# EasyEDA schematic 1-Schematic_MicroCubeSat.json
TITLE: MicroCubeSat_A; REV: 1.0; Date: 2025-03-25; Sheet: 1/1; Drawn By: cookiealpha; Company: Miari
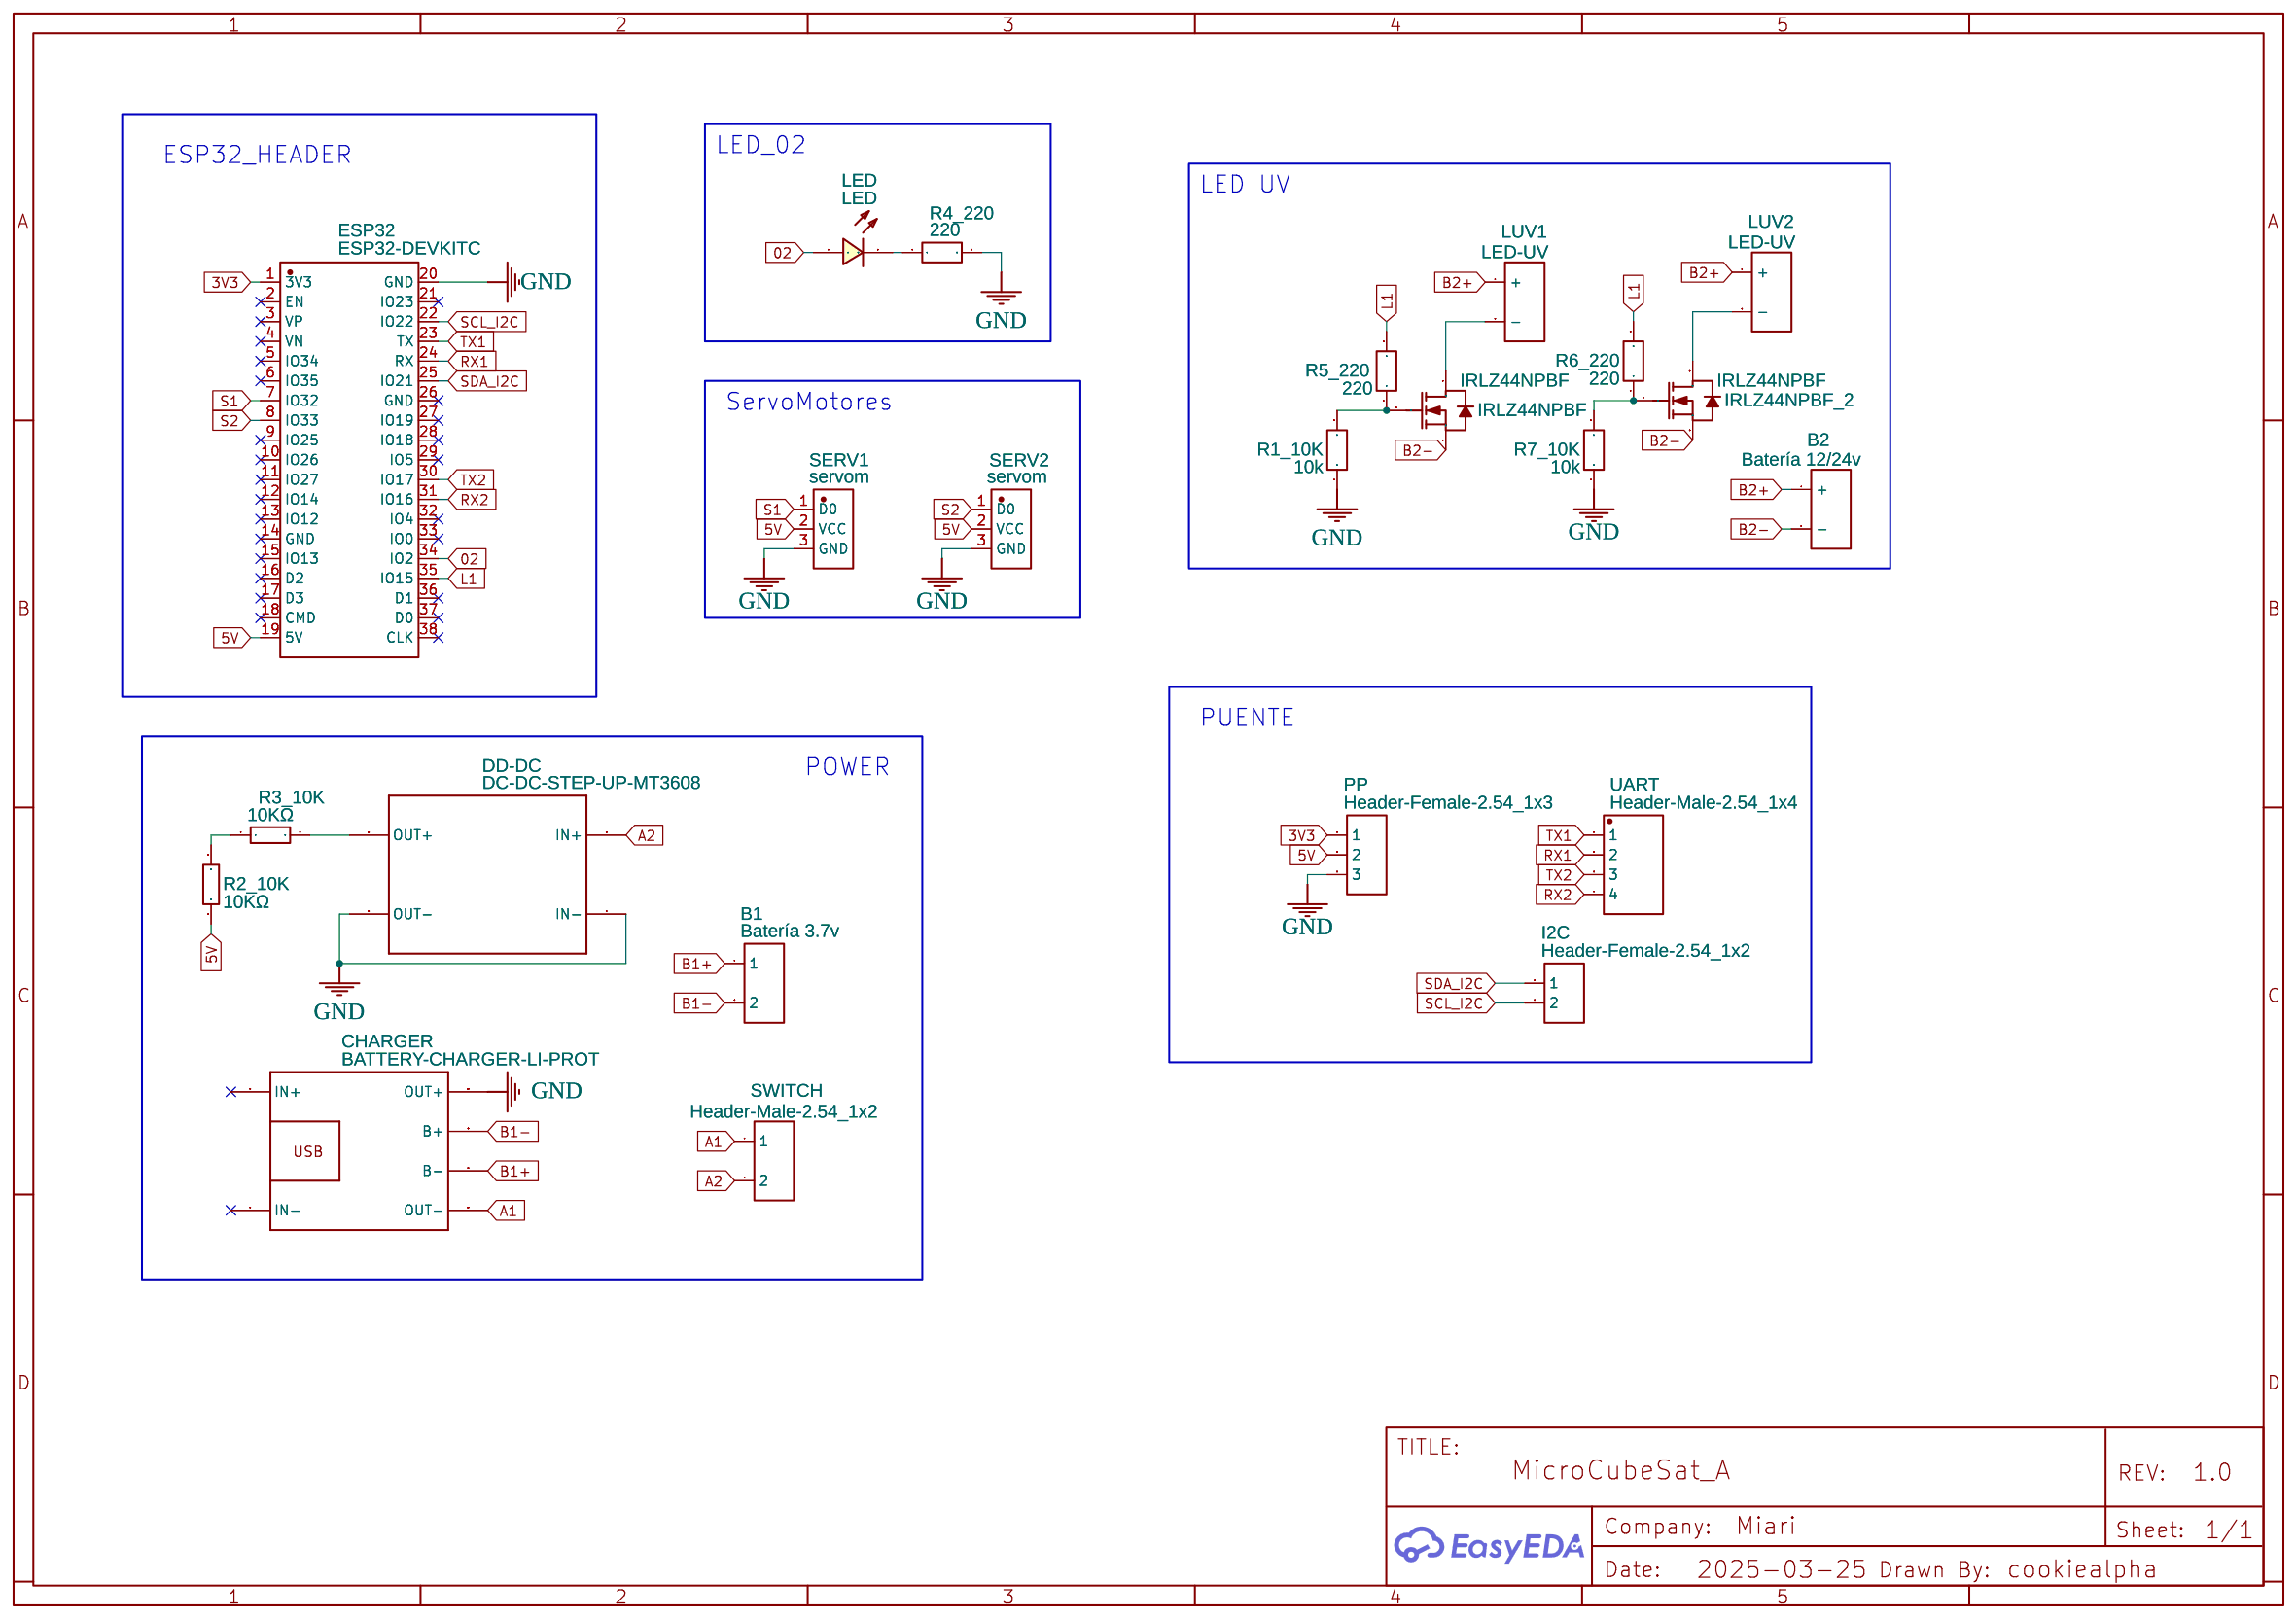
[diagram p0: schematic sheet]

## Parts
B1  Batería 3.7v  [HDR-TH_2P-P2.54-V-M-1]
B2  Batería 12/24v  [HDR-TH_2P-P2.54-V-M-1]
CHARGER  BATTERY-CHARGER-LI-PROT  [BATTERY-CHARGER-LI-PROT]
DD-DC  DC-DC-STEP-UP-MT3608  [DC-DC-STEP-UP-MT3608]
ESP32  ESP32-DEVKITC  [BULETM-SMD_ESP32-DEVKITC]
I2C  Header-Female-2.54_1x2  [HDR-TH_2P-P2.54-V-F]
IRLZ44NPBF  IRLZ44NPBF  [TO-220-3_L10.0-W4.5-P2.54-T]
IRLZ44NPBF_2  IRLZ44NPBF  [TO-220-3_L10.0-W4.5-P2.54-T]
LED  LED  [LED-TH_LED-3MM_RED]
LUV1  LED-UV  [HDR-TH_2P-P2.54-V-M-1]
LUV2  LED-UV  [HDR-TH_2P-P2.54-V-M-1]
PP  Header-Female-2.54_1x3  [HDR-TH_3P-P2.54-V-F]
R1_10K  10k  [RESISTORAXIAL1/2WLHOLES15MM]
R2_10K  10KΩ  [RESISTANCE 10K]
R3_10K  10KΩ  [RESISTANCE 10K]
R4_220  220  [RESISTORAXIAL1/2WLHOLES15MM]
R5_220  220  [RESISTORAXIAL1/2WLHOLES15MM]
R6_220  220  [RESISTORAXIAL1/2WLHOLES15MM]
R7_10K  10k  [RESISTORAXIAL1/2WLHOLES15MM]
SERV1  servom  [CONN-TH_HX-PZ2.54-1X3P-ZZ]
SERV2  servom  [CONN-TH_HX-PZ2.54-1X3P-ZZ]
SWITCH  Header-Male-2.54_1x2  [HDR-TH_2P-P2.54-V-M-1]
UART  Header-Male-2.54_1x4  [HDR-TH_4P-P2.54-V-M]

## Library data of the parts
B1 B2 LUV1 LUV2 SWITCH = Header-Male-2.54_1x2: Supplier: LCSC; Manufacturer: TE Connectivity(泰科电子); Manufacturer Part: 826629-2; Supplier Part: C86471; JLCPCB Part Class: Extended Part
CHARGER = BATTERY-CHARGER-LI-PROT: Contributor: Azias
DD-DC = DC-DC-STEP-UP-MT3608: Contributor: moung
ESP32 = ESP32-DEVKITC: Supplier: LCSC; Supplier Part: C571180; Manufacturer: ESPRESSIF(乐鑫); Manufacturer Part: ESP32-DevKitC; Contributor: lcsc; JLCPCB Part Class: Extended Part
I2C = Header-Female-2.54_1x2: Supplier: LCSC; Manufacturer: BOOMELE(博穆精密); Manufacturer Part: 2.54-1*2P母; Supplier Part: C49661; JLCPCB Part Class: Extended Part
IRLZ44NPBF IRLZ44NPBF_2 = IRLZ44NPBF: Supplier: LCSC; Manufacturer: Infineon(英飞凌); Supplier Part: C38774; JLCPCB Part Class: Extended Part
LED = LED05-红灯: Contributor: LCSC; Supplier: LCSC; Supplier Part: C9900009041; Manufacturer: null; JLCPCB Part Class: Extended Part
PP = Header-Female-2.54_1x3: Supplier Part: C146243; Supplier: LCSC; Manufacturer: BOOMELE(博穆精密); Manufacturer Part: 2.54-1*3P母; JLCPCB Part Class: Extended Part
R1_10K R4_220 R5_220 R6_220 R7_10K = ResistorAxial1/2wLHoles13.89mm: Contributor: 21102406
R2_10K R3_10K = RESISTANCE_10k: Supplier: LCSC; Supplier Part: C123392; Manufacturer: Nanjing Shiheng Elec; Manufacturer Part: MF58 103J3470; Contributor: Evgeniy_ANP; JLCPCB Part Class: Extended Part
SERV1 SERV2 = HX PZ2.54-1X3P ZZ: Supplier: LCSC; Supplier Part: C32713269; Manufacturer: hanxia(韩下); Manufacturer Part: HX PZ2.54-1x3P ZZ; JLCPCB Part Class: Extended Part; Contributor: lcsc
UART = Header-Male-2.54_1x4: Contributor: LCSC; Supplier: LCSC; Manufacturer: Ckmtw(灿科盟); Manufacturer Part: B-2100S04P-A110; Supplier Part: C124378; JLCPCB Part Class: Extended Part

## Nets
3V3: ESP32.1(3V3) PP.1
5V: ESP32.19(5V) PP.2 R2_10K.1 SERV1.2(VCC) SERV2.2(VCC)
GND: CHARGER.OUT+ DD-DC.IN- DD-DC.OUT- ESP32.20(GND) PP.3 R1_10K.1 R4_220.2 R7_10K.1 SERV1.3(GND) SERV2.3(GND)
02: ESP32.34(IO2) LED.1
A1: CHARGER.OUT- SWITCH.1
A2: DD-DC.IN+ SWITCH.2
B1+: B1.1 CHARGER.B-
B1-: B1.2 CHARGER.B+
B2+: B2.1(+) LUV1.1(+) LUV2.1(+)
B2-: B2.2(-) IRLZ44NPBF.3(S) IRLZ44NPBF_2.3(S)
L1: ESP32.35(IO15) R5_220.2 R6_220.2
RX1: ESP32.24(RX) UART.2
RX2: ESP32.31(IO16) UART.4
S1: ESP32.7(IO32) SERV1.1(D0)
S2: ESP32.8(IO33) SERV2.1(D0)
SCL_I2C: ESP32.22(IO22) I2C.2
SDA_I2C: ESP32.25(IO21) I2C.1
TX1: ESP32.23(TX) UART.1
TX2: ESP32.30(IO17) UART.3
Net-(DD-DC-OUT+): DD-DC.OUT+ R3_10K.2
Net-(IRLZ44NPBF-1): IRLZ44NPBF.1(G) R1_10K.2 R5_220.1
Net-(IRLZ44NPBF-2): IRLZ44NPBF.2(D) LUV1.2(-)
Net-(IRLZ44NPBF_2-1): IRLZ44NPBF_2.1(G) R6_220.1 R7_10K.2
Net-(IRLZ44NPBF_2-2): IRLZ44NPBF_2.2(D) LUV2.2(-)
Net-(LED-2): LED.2 R4_220.1
Net-(R2_10K-2): R2_10K.2 R3_10K.1

Not connected (* = marked no-connect by the designer): CHARGER IN+* IN-*; ESP32 2(EN)* 3(VP)* 4(VN)* 5(IO34)* 6(IO35)* 9(IO25)* 10(IO26)* 11(IO27)* 12(IO14)* 13(IO12)* 14(GND)* 15(IO13)* 16(D2)* 17(D3)* 18(CMD)* 21(IO23)* 26(GND)* 27(IO19)* 28(IO18)* 29(IO5)* 32(IO4)* 33(IO0)* 36(D1)* 37(D0)* 38(CLK)*

## Notes on the sheet
- LED_02
- ESP32_HEADER
- LED UV
- ServoMotores
- PUENTE
- POWER
